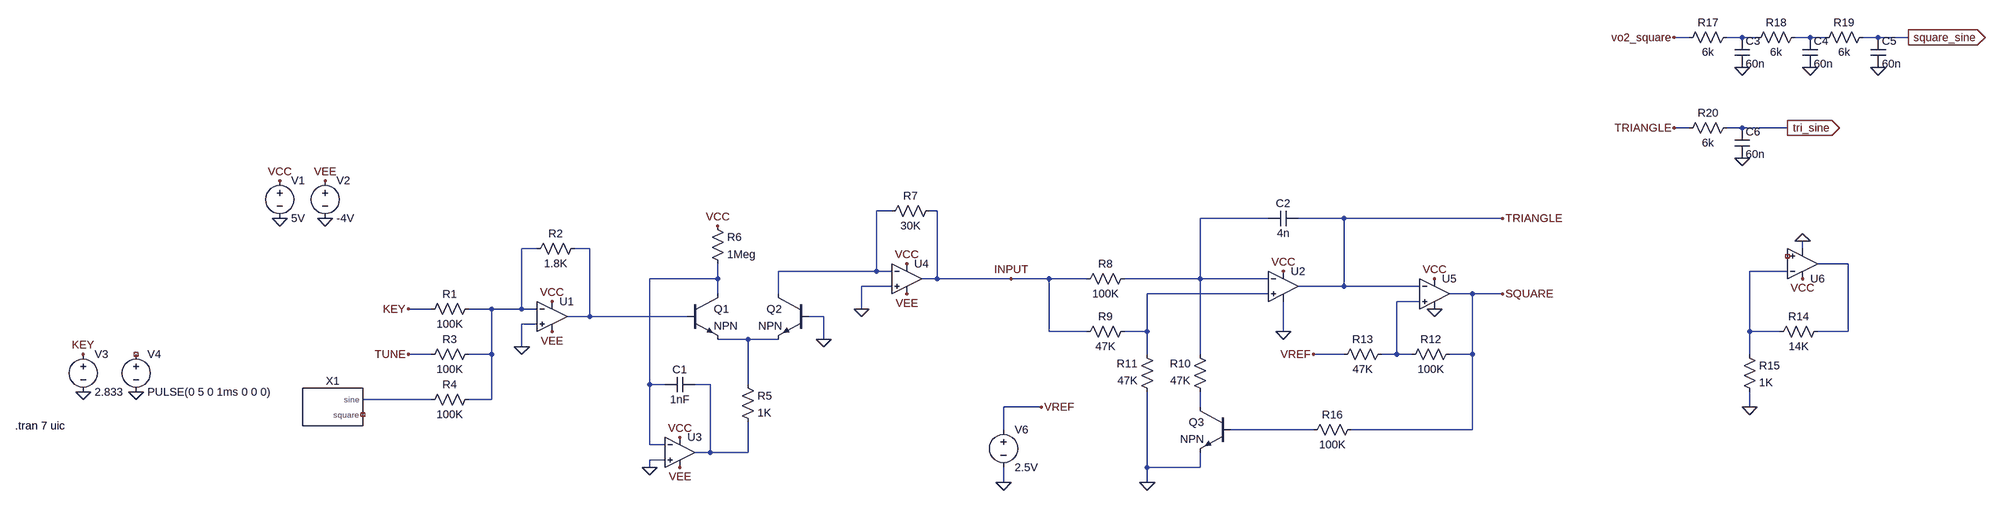
[diagram p0: schematic vco.asc]
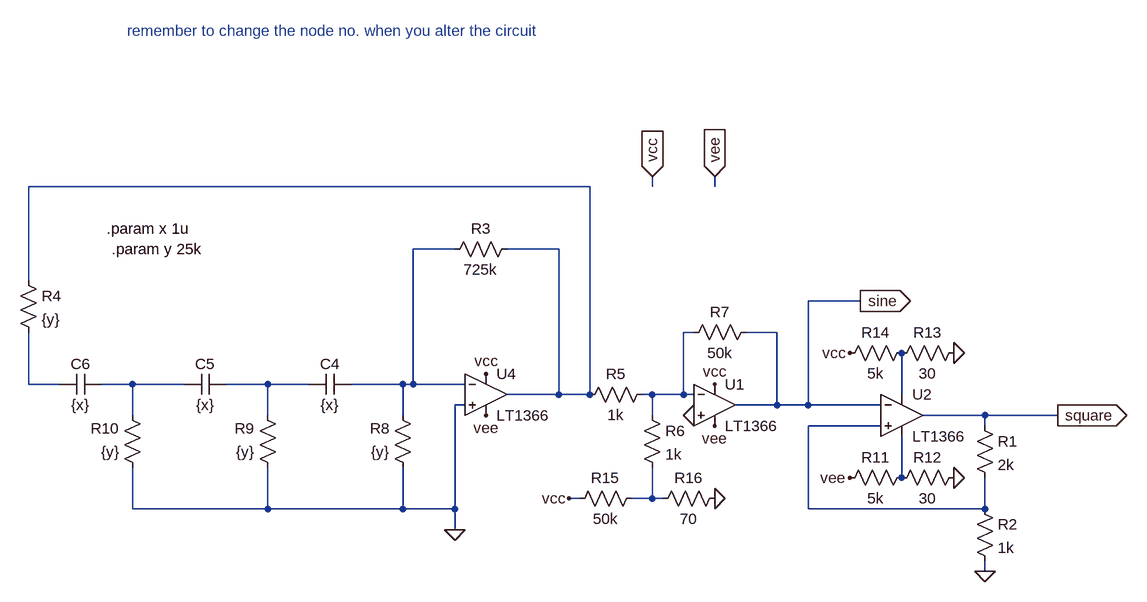
[diagram p1: sub-circuit lfo_new_square.asc]
vco.asc, the LTspice schematic file:
Version 4
SHEET 1 3520 680
WIRE 2880 -496 2848 -496
WIRE 2992 -496 2960 -496
WIRE 3024 -496 2992 -496
WIRE 3136 -496 3104 -496
WIRE 3168 -496 3136 -496
WIRE 3280 -496 3248 -496
WIRE 3344 -496 3280 -496
WIRE 2880 -304 2848 -304
WIRE 2992 -304 2960 -304
WIRE 3088 -304 2992 -304
WIRE 1136 -128 1104 -128
WIRE 1232 -128 1216 -128
WIRE 1936 -112 1792 -112
WIRE 2096 -112 2000 -112
WIRE 2432 -112 2096 -112
WIRE 352 -48 320 -48
WIRE 464 -48 432 -48
WIRE 3120 -48 3120 -64
WIRE 3216 -16 3152 -16
WIRE 1104 0 1104 -128
WIRE 1104 0 896 0
WIRE 1136 0 1104 0
WIRE 3088 0 3008 0
WIRE 768 16 768 -16
WIRE 768 16 624 16
WIRE 1232 16 1232 -128
WIRE 1232 16 1200 16
WIRE 1392 16 1232 16
WIRE 1472 16 1392 16
WIRE 1552 16 1472 16
WIRE 1792 16 1792 -112
WIRE 1792 16 1632 16
WIRE 1936 16 1792 16
WIRE 1136 32 1072 32
WIRE 2096 32 2096 -112
WIRE 2096 32 2000 32
WIRE 2256 32 2096 32
WIRE 768 48 768 16
WIRE 896 48 896 0
WIRE 1936 48 1680 48
WIRE 2368 48 2320 48
WIRE 2432 48 2368 48
WIRE 2256 64 2208 64
WIRE 128 80 80 80
WIRE 256 80 208 80
WIRE 320 80 320 -48
WIRE 320 80 256 80
WIRE 352 80 320 80
WIRE 1072 80 1072 32
WIRE 464 96 464 -48
WIRE 464 96 416 96
WIRE 704 96 464 96
WIRE 992 96 960 96
WIRE 352 112 320 112
WIRE 1472 128 1472 16
WIRE 1552 128 1472 128
WIRE 1680 128 1680 48
WIRE 1680 128 1632 128
WIRE 1968 128 1968 64
WIRE 3008 128 3008 0
WIRE 3072 128 3008 128
WIRE 3216 128 3216 -16
WIRE 3216 128 3152 128
WIRE 832 144 768 144
WIRE 896 144 832 144
WIRE 992 144 992 96
WIRE 320 160 320 112
WIRE 128 176 80 176
WIRE 256 176 256 80
WIRE 256 176 208 176
WIRE 1680 176 1680 128
WIRE 1792 176 1792 16
WIRE 2096 176 2032 176
WIRE 2208 176 2208 64
WIRE 2208 176 2176 176
WIRE 2240 176 2208 176
WIRE 2368 176 2368 48
WIRE 2368 176 2320 176
WIRE 3008 176 3008 128
WIRE 624 240 624 16
WIRE 656 240 624 240
WIRE 752 240 720 240
WIRE 832 240 832 144
WIRE 128 272 -16 272
WIRE 256 272 256 176
WIRE 256 272 208 272
WIRE 1456 288 1376 288
WIRE 1792 288 1792 256
WIRE 3008 288 3008 256
WIRE 1376 336 1376 288
WIRE 2032 336 1856 336
WIRE 2368 336 2368 176
WIRE 2368 336 2112 336
WIRE 624 368 624 240
WIRE 656 368 624 368
WIRE 752 384 752 240
WIRE 752 384 720 384
WIRE 832 384 832 320
WIRE 832 384 752 384
WIRE 656 400 624 400
WIRE 624 416 624 400
WIRE 1680 416 1680 256
WIRE 1792 416 1792 384
WIRE 1792 416 1680 416
WIRE 1376 448 1376 416
WIRE 1680 448 1680 416
FLAG 384 64 VCC
FLAG 384 128 VEE
FLAG 320 160 0
FLAG -192 -112 0
FLAG -96 -112 0
FLAG -96 -192 VEE
FLAG -192 -192 VCC
FLAG 80 80 KEY
FLAG 80 176 TUNE
FLAG -608 256 0
FLAG 688 416 VEE
FLAG 688 352 VCC
FLAG 624 416 0
FLAG 992 144 0
FLAG 768 -96 VCC
FLAG -496 256 0
FLAG -608 176 KEY
FLAG 1168 48 VEE
FLAG 1168 -16 VCC
FLAG 1072 80 0
FLAG 1968 0 VCC
FLAG 1680 448 0
FLAG 2288 16 VCC
FLAG 1968 128 0
FLAG 2288 80 0
FLAG 3120 16 VCC
FLAG 3120 -64 0
FLAG 3008 288 0
FLAG 1376 448 0
FLAG 2432 48 SQUARE
FLAG 2432 -112 TRIANGLE
FLAG 2032 176 VREF
FLAG 1456 288 VREF
FLAG 1392 16 INPUT
FLAG 3280 -432 0
FLAG 3136 -432 0
FLAG 2992 -432 0
FLAG 2992 -240 0
FLAG 2848 -496 vo2_square
FLAG 3088 -304 tri_sine
IOPIN 3088 -304 Out
FLAG 3344 -496 square_sine
IOPIN 3344 -496 Out
FLAG 2848 -304 TRIANGLE
SYMBOL res 224 64 R90
WINDOW 0 0 56 VBottom 2
WINDOW 3 32 56 VTop 2
SYMATTR InstName R1
SYMATTR Value 100K
SYMBOL UniversalOpamp2 384 96 R0
SYMATTR InstName U1
SYMBOL res 448 -64 R90
WINDOW 0 0 56 VBottom 2
WINDOW 3 32 56 VTop 2
SYMATTR InstName R2
SYMATTR Value 1.8K
SYMBOL res 224 160 R90
WINDOW 0 0 56 VBottom 2
WINDOW 3 32 56 VTop 2
SYMATTR InstName R3
SYMATTR Value 100K
SYMBOL res 224 256 R90
WINDOW 0 0 56 VBottom 2
WINDOW 3 32 56 VTop 2
SYMATTR InstName R4
SYMATTR Value 100K
SYMBOL voltage -192 -208 R0
WINDOW 123 0 0 Left 2
WINDOW 39 0 0 Left 2
SYMATTR InstName V1
SYMATTR Value 5V
SYMBOL voltage -96 -208 R0
WINDOW 123 0 0 Left 2
WINDOW 39 0 0 Left 2
SYMATTR InstName V2
SYMATTR Value -4V
SYMBOL voltage -608 160 R0
WINDOW 123 0 0 Left 2
WINDOW 39 0 0 Left 2
SYMATTR InstName V3
SYMATTR Value 2.833
SYMBOL npn 704 48 R0
SYMATTR InstName Q1
SYMBOL npn 960 48 M0
SYMATTR InstName Q2
SYMBOL UniversalOpamp2 688 384 R0
SYMATTR InstName U3
SYMBOL cap 720 224 R90
WINDOW 0 0 32 VBottom 2
WINDOW 3 32 32 VTop 2
SYMATTR InstName C1
SYMATTR Value 1nF
SYMBOL res 816 224 R0
SYMATTR InstName R5
SYMATTR Value 1K
SYMBOL res 752 -112 R0
SYMATTR InstName R6
SYMATTR Value 1Meg
SYMBOL voltage -496 160 R0
WINDOW 123 0 0 Left 2
WINDOW 39 0 0 Left 2
SYMATTR InstName V4
SYMATTR Value PULSE(0 5 0 1ms 0 0 0)
SYMBOL UniversalOpamp2 1168 16 R0
SYMATTR InstName U4
SYMBOL res 1232 -144 R90
WINDOW 0 0 56 VBottom 2
WINDOW 3 32 56 VTop 2
SYMATTR InstName R7
SYMATTR Value 30K
SYMBOL UniversalOpamp2 1968 32 R0
SYMATTR InstName U2
SYMBOL res 1648 0 R90
WINDOW 0 0 56 VBottom 2
WINDOW 3 32 56 VTop 2
SYMATTR InstName R8
SYMATTR Value 100K
SYMBOL res 1648 112 R90
WINDOW 0 0 56 VBottom 2
WINDOW 3 32 56 VTop 2
SYMATTR InstName R9
SYMATTR Value 47K
SYMBOL res 1808 272 R180
WINDOW 0 36 76 Left 2
WINDOW 3 36 40 Left 2
SYMATTR InstName R10
SYMATTR Value 47K
SYMBOL res 1696 272 R180
WINDOW 0 36 76 Left 2
WINDOW 3 36 40 Left 2
SYMATTR InstName R11
SYMATTR Value 47K
SYMBOL npn 1856 288 M0
SYMATTR InstName Q3
SYMBOL cap 2000 -128 R90
WINDOW 0 0 32 VBottom 2
WINDOW 3 32 32 VTop 2
SYMATTR InstName C2
SYMATTR Value 4n
SYMBOL UniversalOpamp2 2288 48 R0
SYMATTR InstName U5
SYMBOL res 2336 160 R90
WINDOW 0 0 56 VBottom 2
WINDOW 3 32 56 VTop 2
SYMATTR InstName R12
SYMATTR Value 100K
SYMBOL res 2192 160 R90
WINDOW 0 0 56 VBottom 2
WINDOW 3 32 56 VTop 2
SYMATTR InstName R13
SYMATTR Value 47K
SYMBOL UniversalOpamp2 3120 -16 M180
SYMATTR InstName U6
SYMBOL res 3168 112 R90
WINDOW 0 0 56 VBottom 2
WINDOW 3 32 56 VTop 2
SYMATTR InstName R14
SYMATTR Value 14K
SYMBOL res 2992 160 R0
SYMATTR InstName R15
SYMATTR Value 1K
SYMBOL res 2128 320 R90
WINDOW 0 0 56 VBottom 2
WINDOW 3 32 56 VTop 2
SYMATTR InstName R16
SYMATTR Value 100K
SYMBOL voltage 1376 320 R0
WINDOW 123 0 0 Left 2
WINDOW 39 0 0 Left 2
SYMATTR InstName V6
SYMATTR Value 2.5V
SYMBOL lfo_new_square -80 288 R0
SYMATTR InstName X1
SYMBOL res 2976 -512 R90
WINDOW 0 0 56 VBottom 2
WINDOW 3 32 56 VTop 2
SYMATTR InstName R17
SYMATTR Value 6k
SYMBOL res 3120 -512 R90
WINDOW 0 0 56 VBottom 2
WINDOW 3 32 56 VTop 2
SYMATTR InstName R18
SYMATTR Value 6k
SYMBOL res 3264 -512 R90
WINDOW 0 0 56 VBottom 2
WINDOW 3 32 56 VTop 2
SYMATTR InstName R19
SYMATTR Value 6k
SYMBOL cap 2976 -496 R0
SYMATTR InstName C3
SYMATTR Value 60n
SYMBOL cap 3120 -496 R0
SYMATTR InstName C4
SYMATTR Value 60n
SYMBOL cap 3264 -496 R0
SYMATTR InstName C5
SYMATTR Value 60n
SYMBOL res 2976 -320 R90
WINDOW 0 0 56 VBottom 2
WINDOW 3 32 56 VTop 2
SYMATTR InstName R20
SYMATTR Value 6k
SYMBOL cap 2976 -304 R0
SYMATTR InstName C6
SYMATTR Value 60n
TEXT -752 328 Left 2 !.tran 7 uic

lfo_new_square.asc, the sub-circuit schematic file:
Version 4
SHEET 1 1144 880
WIRE -576 -144 -1440 -144
WIRE -480 -144 -480 -160
WIRE -384 -144 -384 -160
WIRE -784 -48 -848 -48
WIRE -624 -48 -704 -48
WIRE -1440 0 -1440 -144
WIRE -160 32 -240 32
WIRE -416 80 -432 80
WIRE -288 80 -336 80
WIRE -1440 160 -1440 80
WIRE -1392 160 -1440 160
WIRE -1280 160 -1328 160
WIRE -1200 160 -1280 160
WIRE -1072 160 -1136 160
WIRE -1008 160 -1072 160
WIRE -864 160 -944 160
WIRE -848 160 -848 -48
WIRE -848 160 -864 160
WIRE -768 160 -848 160
WIRE -624 176 -624 -48
WIRE -624 176 -704 176
WIRE -576 176 -576 -144
WIRE -576 176 -624 176
WIRE -480 176 -496 176
WIRE -432 176 -432 80
WIRE -432 176 -480 176
WIRE -416 176 -432 176
WIRE -96 176 -96 112
WIRE -768 192 -784 192
WIRE -288 192 -288 80
WIRE -288 192 -352 192
WIRE -240 192 -240 32
WIRE -240 192 -288 192
WIRE -128 192 -240 192
WIRE -1280 208 -1280 160
WIRE -1072 208 -1072 160
WIRE -864 208 -864 160
WIRE -480 208 -480 176
WIRE 32 208 -64 208
WIRE 144 208 32 208
WIRE -128 224 -240 224
WIRE 32 224 32 208
WIRE -96 304 -96 240
WIRE -592 336 -608 336
WIRE -480 336 -480 288
WIRE -480 336 -512 336
WIRE -464 336 -480 336
WIRE -1280 352 -1280 288
WIRE -1072 352 -1072 288
WIRE -1072 352 -1280 352
WIRE -864 352 -864 288
WIRE -864 352 -1072 352
WIRE -784 352 -784 192
WIRE -784 352 -864 352
WIRE -240 352 -240 224
WIRE 32 352 32 304
WIRE 32 352 -240 352
WIRE -784 384 -784 352
WIRE 32 448 32 432
FLAG 32 448 0
FLAG -784 384 0
FLAG -480 -160 vcc
IOPIN -480 -160 In
FLAG -384 -160 vee
IOPIN -384 -160 In
FLAG -736 144 vcc
FLAG -736 208 vee
FLAG 144 208 square
IOPIN 144 208 Out
FLAG -160 32 sine
IOPIN -160 32 Out
FLAG -416 208 0
FLAG -384 160 vcc
FLAG -384 224 vee
FLAG -16 112 0
FLAG -16 304 0
FLAG -176 112 vcc
FLAG -176 304 vee
FLAG -384 336 0
FLAG -608 336 vcc
SYMBOL res 16 208 R0
SYMATTR InstName R1
SYMATTR Value 2k
SYMBOL res 16 336 R0
SYMATTR InstName R2
SYMATTR Value 1k
SYMBOL cap -944 144 R90
WINDOW 0 0 32 VBottom 2
WINDOW 3 32 32 VTop 2
SYMATTR InstName C4
SYMATTR Value {x}
SYMBOL cap -1136 144 R90
WINDOW 0 0 32 VBottom 2
WINDOW 3 32 32 VTop 2
SYMATTR InstName C5
SYMATTR Value {x}
SYMBOL cap -1328 144 R90
WINDOW 0 0 32 VBottom 2
WINDOW 3 32 32 VTop 2
SYMATTR InstName C6
SYMATTR Value {x}
SYMBOL res -848 304 R180
WINDOW 0 36 76 Left 2
WINDOW 3 36 40 Left 2
SYMATTR InstName R8
SYMATTR Value {y}
SYMBOL res -1056 304 R180
WINDOW 0 36 76 Left 2
WINDOW 3 36 40 Left 2
SYMATTR InstName R9
SYMATTR Value {y}
SYMBOL res -1264 304 R180
WINDOW 0 36 76 Left 2
WINDOW 3 36 40 Left 2
SYMATTR InstName R10
SYMATTR Value {y}
SYMBOL Opamps/LT1366 -736 112 R0
SYMATTR InstName U4
SYMBOL Opamps/LT1366 -96 144 R0
SYMATTR InstName U2
SYMBOL res -688 -64 R90
WINDOW 0 0 56 VBottom 2
WINDOW 3 32 56 VTop 2
SYMATTR InstName R3
SYMATTR Value 725k
SYMBOL Opamps/LT1366 -384 128 R0
SYMATTR InstName U1
SYMBOL res -480 160 R90
WINDOW 0 0 56 VBottom 2
WINDOW 3 32 56 VTop 2
SYMATTR InstName R5
SYMATTR Value 1k
SYMBOL res -496 192 R0
SYMATTR InstName R6
SYMATTR Value 1k
SYMBOL res -320 64 R90
WINDOW 0 0 56 VBottom 2
WINDOW 3 32 56 VTop 2
SYMATTR InstName R7
SYMATTR Value 50k
SYMBOL res -80 288 R90
WINDOW 0 0 56 VBottom 2
WINDOW 3 32 56 VTop 2
SYMATTR InstName R11
SYMATTR Value 5k
SYMBOL res 0 288 R90
WINDOW 0 0 56 VBottom 2
WINDOW 3 32 56 VTop 2
SYMATTR InstName R12
SYMATTR Value 30
SYMBOL res 0 96 R90
WINDOW 0 0 56 VBottom 2
WINDOW 3 32 56 VTop 2
SYMATTR InstName R13
SYMATTR Value 30
SYMBOL res -80 96 R90
WINDOW 0 0 56 VBottom 2
WINDOW 3 32 56 VTop 2
SYMATTR InstName R14
SYMATTR Value 5k
SYMBOL res -1456 -16 R0
SYMATTR InstName R4
SYMATTR Value {y}
SYMBOL res -608 352 R270
WINDOW 0 32 56 VTop 2
WINDOW 3 0 56 VBottom 2
SYMATTR InstName R15
SYMATTR Value 50k
SYMBOL res -480 352 R270
WINDOW 0 32 56 VTop 2
WINDOW 3 0 56 VBottom 2
SYMATTR InstName R16
SYMATTR Value 70
TEXT -1320 -80 Left 2 !.param x 1u
TEXT -1312 -48 Left 2 !.param y 25k
TEXT -1288 -384 Left 2 ;remember to change the node no. when you alter the circuit

The netlist it stands for:
* vco.asc
R1 N005 KEY 100K
XU1 0 N005 VCC VEE N006 level.2 Avol=1Meg GBW=10Meg Slew=10Meg ilimit=25m rail=0 Vos=0 phimargin=45 en=0 enk=0 in=0 ink=0 Rin=500Meg  ; pins IN+ IN- V+ V- OUT
R2 N006 N005 1.8K
R3 N005 TUNE 100K
R4 N005 N014 100K
V1 VCC 0 5V
V2 VEE 0 -4V
V3 KEY 0 2.833
Q1 N009 N006 N012 0 NPN
Q2 N003 0 N012 0 NPN
XU3 0 N009 VCC VEE N013 level.2 Avol=1Meg GBW=10Meg Slew=10Meg ilimit=25m rail=0 Vos=0 phimargin=45 en=0 enk=0 in=0 ink=0 Rin=500Meg  ; pins IN+ IN- V+ V- OUT
C1 N013 N009 1nF
R5 N012 N013 1K
R6 VCC N009 1Meg
V4 NC_01 0 PULSE(0 5 0 1ms 0 0 0)
XU4 0 N003 VCC VEE INPUT level.2 Avol=1Meg GBW=10Meg Slew=10Meg ilimit=25m rail=0 Vos=0 phimargin=45 en=0 enk=0 in=0 ink=0 Rin=500Meg  ; pins IN+ IN- V+ V- OUT
R7 INPUT N003 30K
XU2 N010 N004 VCC 0 TRIANGLE level.2 Avol=1Meg GBW=10Meg Slew=10Meg ilimit=25m rail=0 Vos=0 phimargin=45 en=0 enk=0 in=0 ink=0 Rin=500Meg  ; pins IN+ IN- V+ V- OUT
R8 N004 INPUT 100K
R9 N010 INPUT 47K
R10 N015 N004 47K
R11 0 N010 47K
Q3 N015 N016 0 0 NPN
C2 TRIANGLE N004 4n
XU5 N011 TRIANGLE VCC 0 SQUARE level.2 Avol=1Meg GBW=10Meg Slew=10Meg ilimit=25m rail=0 Vos=0 phimargin=45 en=0 enk=0 in=0 ink=0 Rin=500Meg  ; pins IN+ IN- V+ V- OUT
R12 SQUARE N011 100K
R13 N011 VREF 47K
XU6 NC_02 N008 VCC 0 N007 level.2 Avol=1Meg GBW=10Meg Slew=10Meg ilimit=25m rail=0 Vos=0 phimargin=45 en=0 enk=0 in=0 ink=0 Rin=500Meg  ; pins IN+ IN- V+ V- OUT
R14 N007 N008 14K
R15 N008 0 1K
R16 SQUARE N016 100K
V6 VREF 0 2.5V
XX1 N014 NC_03 lfo_new_square
R17 N001 vo2_square 6k
R18 N002 N001 6k
R19 square_sine N002 6k
C3 N001 0 60n
C4 N002 0 60n
C5 square_sine 0 60n
R20 tri_sine TRIANGLE 6k
C6 tri_sine 0 60n

* block symbol definitions
.subckt lfo_new_square sine square
R1 square N008 2k
R2 N008 0 1k
C4 N002 N006 {x}
C5 N006 N005 {x}
C6 N005 N004 {x}
R8 0 N002 {y}
R9 0 N006 {y}
R10 0 N005 {y}
XU4 0 N002 vcc vee N001 LT1366  ; pins In+ In- V+ V- OUT
XU2 N008 sine N007 N009 square LT1366  ; pins In+ In- V+ V- OUT
R3 N001 N002 725k
XU1 0 N003 vcc vee sine LT1366  ; pins In+ In- V+ V- OUT
R5 N003 N001 1k
R6 N003 N010 1k
R7 sine N003 50k
R11 N009 vee 5k
R12 0 N009 30
R13 0 N007 30
R14 N007 vcc 5k
R4 N001 N004 {y}
R15 vcc N010 50k
R16 N010 0 70
.param x 1u
.param y 25k
* remember to change the node no. when you alter the circuit
.ends lfo_new_square

.model NPN NPN
.model PNP PNP
.lib standard.bjt
.tran 7 uic
.lib UniversalOpamps2.sub
.lib LTC.lib
.backanno
.end